# Altium schematic sheet contactor_connectors.SchDoc: foxBMS BMS-Master
size A3; DocumentNumber: 18; SheetNumber: 18; SheetTotal: 24; Author: Fraunhofer IISB foxBMS Team; REL-DATE: 2017-05-16; VERSION: 1.0.2; SheetDescription: Contactor Connectors
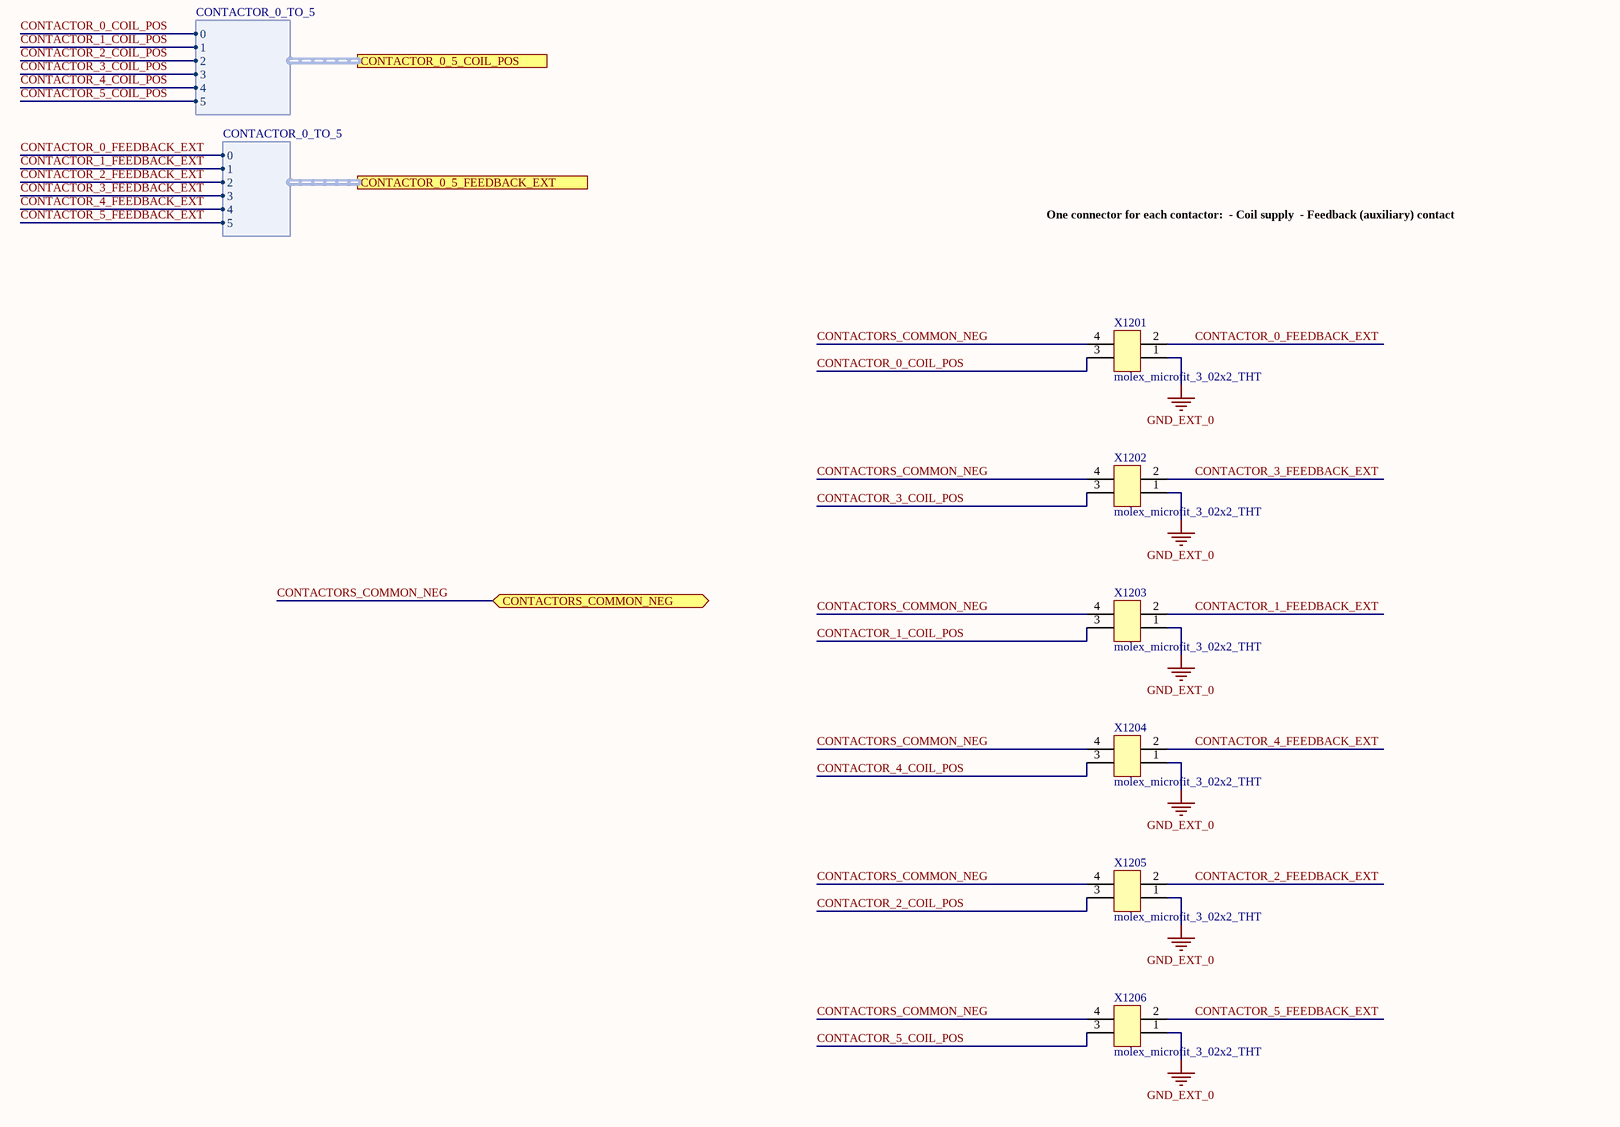
[diagram p0: contactor_connectors.SchDoc]

## Parts
X1201  molex_microfit_3_02x2_THT  [MOLEX_MICROFIT_02x2_THT]
X1202  molex_microfit_3_02x2_THT  [MOLEX_MICROFIT_02x2_THT]
X1203  molex_microfit_3_02x2_THT  [MOLEX_MICROFIT_02x2_THT]
X1204  molex_microfit_3_02x2_THT  [MOLEX_MICROFIT_02x2_THT]
X1205  molex_microfit_3_02x2_THT  [MOLEX_MICROFIT_02x2_THT]
X1206  molex_microfit_3_02x2_THT  [MOLEX_MICROFIT_02x2_THT]

## Ports
CONTACTOR_0_5_COIL_POS (harness CONTACTOR_0_TO_5), CONTACTOR_0_5_FEEDBACK_EXT (harness CONTACTOR_0_TO_5), CONTACTORS_COMMON_NEG (bidir)

## Harnesses
CONTACTOR_0_TO_5: 0, 1, 2, 3, 4, 5

## Nets
GND_EXT_0: X1201.1 X1202.1 X1203.1 X1204.1 X1205.1 X1206.1
CONTACTOR_0_COIL_POS: X1201.3 ; port CONTACTOR_0_5_COIL_POS.0
CONTACTOR_0_FEEDBACK_EXT: X1201.2 ; port CONTACTOR_0_5_FEEDBACK_EXT.0
CONTACTOR_1_COIL_POS: X1203.3 ; port CONTACTOR_0_5_COIL_POS.1
CONTACTOR_1_FEEDBACK_EXT: X1203.2 ; port CONTACTOR_0_5_FEEDBACK_EXT.1
CONTACTOR_2_COIL_POS: X1205.3 ; port CONTACTOR_0_5_COIL_POS.2
CONTACTOR_2_FEEDBACK_EXT: X1205.2 ; port CONTACTOR_0_5_FEEDBACK_EXT.2
CONTACTOR_3_COIL_POS: X1202.3 ; port CONTACTOR_0_5_COIL_POS.3
CONTACTOR_3_FEEDBACK_EXT: X1202.2 ; port CONTACTOR_0_5_FEEDBACK_EXT.3
CONTACTOR_4_COIL_POS: X1204.3 ; port CONTACTOR_0_5_COIL_POS.4
CONTACTOR_4_FEEDBACK_EXT: X1204.2 ; port CONTACTOR_0_5_FEEDBACK_EXT.4
CONTACTOR_5_COIL_POS: X1206.3 ; port CONTACTOR_0_5_COIL_POS.5
CONTACTOR_5_FEEDBACK_EXT: X1206.2 ; port CONTACTOR_0_5_FEEDBACK_EXT.5
CONTACTORS_COMMON_NEG: X1201.4 X1202.4 X1203.4 X1204.4 X1205.4 X1206.4 ; port CONTACTORS_COMMON_NEG

## Notes on the sheet
- One connector for each contactor:
  - Coil supply
  - Feedback (auxiliary) contact
- Fraunhofer IISB
- Schottkystr. 10
- developed by:
- 91058 Erlangen
- Germany
- Author
- Project
- License
- Description
- File
- Version
- Release Date
- Sheet
- www.foxbms.org
- www.iisb.fraunhofer.de
- foxBMS Team
- /

## Library data of the parts
X1201-X1206 = molex_microfit_3_02x2_THT: Micro-Fit 3.0 Right Angle Header, 3.00mm Pitch, Dual Row, 4 Circuits, with Snap-in Plastic Peg PCB Lock, Tin, Glow Wire Capable, Black, 43045-0400; Manufacturer: Molex; Circuits: 4; Rated Voltage: 600V; Rated Current: 8.5A; Automotive Qualified: False; Part Number: molex_microfit_3_02x2_THT; Part Name: MicroFit; Operating Temperature: -40°C - +105°C; Supplier 1: Farnell; Supplier Part Number 1: 9733019